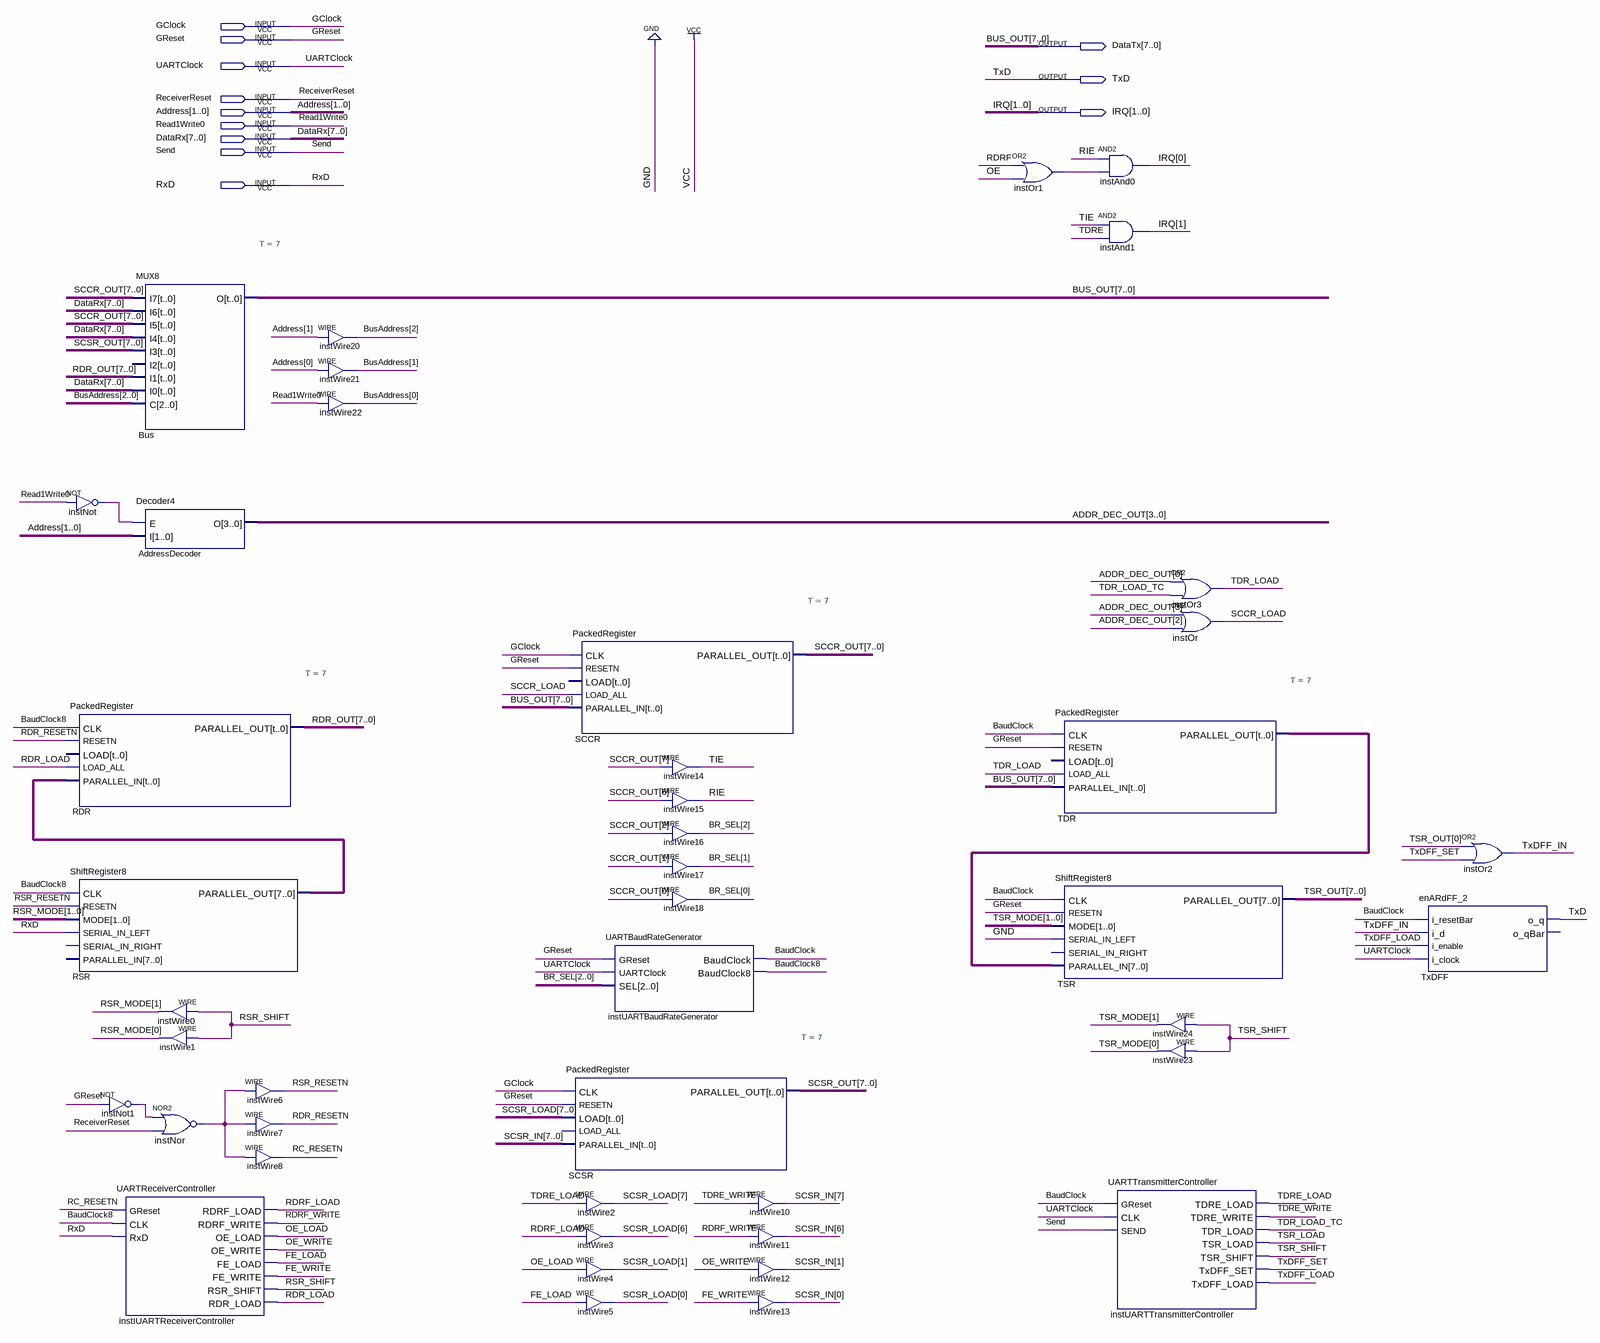
[diagram p0: schematic sheet]
// Quartus schematic UART.bdf as structural Verilog: 44 symbols, 12 pins
module UART (
  input  GClock,
  input  GReset,
  input  UARTClock,
  input  ReceiverReset,
  input  [1:0] Address,
  input  Read1Write0,
  input  [7:0] DataRx,
  input  Send,
  input  RxD,
  output [7:0] DataTx,
  output TxD,
  output [1:0] IRQ
);

  wire BaudClock, BaudClock8, FE_LOAD, FE_WRITE, instNor_out, instNot1_out, instNot_out, instOr1_out, OE,
       OE_LOAD, OE_WRITE, RC_RESETN, RDR_LOAD, RDR_RESETN, RDRF, RDRF_LOAD, RDRF_WRITE, RIE, RSR_RESETN,
       RSR_SHIFT, SCCR_LOAD, TDR_LOAD, TDR_LOAD_TC, TDRE, TDRE_LOAD, TDRE_WRITE, TIE, TSR_LOAD, TSR_SHIFT,
       TxDFF_IN, TxDFF_LOAD, TxDFF_SET;
  wire [1:0] RSR_MODE, TSR_MODE;
  wire [2:0] BR_SEL, BusAddress;
  wire [3:0] ADDR_DEC_OUT;
  wire [7:0] RDR_OUT, RSR_parallel_out, SCCR_OUT, SCSR_IN, SCSR_LOAD, SCSR_OUT, TDR_parallel_out, TSR_OUT;

  not instNot (instNot_out, Read1Write0);
  PackedRegister #(.T(7)) RDR (
    .CLK(BaudClock8), .RESETN(RDR_RESETN), .LOAD_ALL(RDR_LOAD), .PARALLEL_IN(RSR_parallel_out),
    .PARALLEL_OUT(RDR_OUT));  // open: LOAD
  ShiftRegister8 RSR (
    .CLK(BaudClock8), .RESETN(RSR_RESETN), .MODE(RSR_MODE), .SERIAL_IN_LEFT(RxD),
    .PARALLEL_OUT(RSR_parallel_out));  // open: SERIAL_IN_RIGHT, PARALLEL_IN
  not instNot1 (instNot1_out, GReset);
  MUX8 #(.T(7)) Bus (
    .I7(SCCR_OUT), .I6(DataRx), .I5(SCCR_OUT), .I4(DataRx), .I3(SCSR_OUT), .I1(RDR_OUT), .I0(DataRx),
    .C(BusAddress), .O(DataTx));  // open: I2
  Decoder4 AddressDecoder (.E(instNot_out), .I(Address), .O(ADDR_DEC_OUT));
  nor instNor (instNor_out, instNot1_out, ReceiverReset);
  UARTReceiverController instIUARTReceiverController (
    .GReset(RC_RESETN), .CLK(BaudClock8), .RxD(RxD), .RDRF_LOAD(RDRF_LOAD), .RDRF_WRITE(RDRF_WRITE),
    .OE_LOAD(OE_LOAD), .OE_WRITE(OE_WRITE), .FE_LOAD(FE_LOAD), .FE_WRITE(FE_WRITE), .RSR_SHIFT(RSR_SHIFT),
    .RDR_LOAD(RDR_LOAD));
  assign RSR_MODE[1] = RSR_SHIFT;  // WIRE instWire0
  assign RSR_MODE[0] = RSR_SHIFT;  // WIRE instWire1
  assign RSR_RESETN = instNor_out;  // WIRE instWire6
  assign RDR_RESETN = instNor_out;  // WIRE instWire7
  assign RC_RESETN = instNor_out;  // WIRE instWire8
  assign BusAddress[2] = Address[1];  // WIRE instWire20
  assign BusAddress[1] = Address[0];  // WIRE instWire21
  assign BusAddress[0] = Read1Write0;  // WIRE instWire22
  PackedRegister #(.T(7)) SCCR (
    .CLK(GClock), .RESETN(GReset), .LOAD_ALL(SCCR_LOAD), .PARALLEL_IN(DataTx), .PARALLEL_OUT(SCCR_OUT));  // open: LOAD
  PackedRegister #(.T(7)) SCSR (
    .CLK(GClock), .RESETN(GReset), .LOAD(SCSR_LOAD), .PARALLEL_IN(SCSR_IN), .PARALLEL_OUT(SCSR_OUT));  // open: LOAD_ALL
  assign SCSR_LOAD[7] = TDRE_LOAD;  // WIRE instWire2
  assign SCSR_LOAD[6] = RDRF_LOAD;  // WIRE instWire3
  assign SCSR_LOAD[1] = OE_LOAD;  // WIRE instWire4
  assign SCSR_LOAD[0] = FE_LOAD;  // WIRE instWire5
  UARTBaudRateGenerator instUARTBaudRateGenerator (
    .GReset(GReset), .UARTClock(UARTClock), .SEL(BR_SEL), .BaudClock(BaudClock), .BaudClock8(BaudClock8));
  assign TIE = SCCR_OUT[7];  // WIRE instWire14
  assign RIE = SCCR_OUT[6];  // WIRE instWire15
  assign BR_SEL[2] = SCCR_OUT[2];  // WIRE instWire16
  assign BR_SEL[1] = SCCR_OUT[1];  // WIRE instWire17
  assign BR_SEL[0] = SCCR_OUT[0];  // WIRE instWire18
  assign SCSR_IN[7] = TDRE_WRITE;  // WIRE instWire10
  assign SCSR_IN[6] = RDRF_WRITE;  // WIRE instWire11
  assign SCSR_IN[1] = OE_WRITE;  // WIRE instWire12
  assign SCSR_IN[0] = FE_WRITE;  // WIRE instWire13
  or instOr1 (instOr1_out, RDRF, OE);
  PackedRegister #(.T(7)) TDR (
    .CLK(BaudClock), .RESETN(GReset), .LOAD_ALL(TDR_LOAD), .PARALLEL_IN(DataTx),
    .PARALLEL_OUT(TDR_parallel_out));  // open: LOAD
  ShiftRegister8 TSR (
    .CLK(BaudClock), .RESETN(GReset), .MODE(TSR_MODE), .SERIAL_IN_LEFT(1'b0), .PARALLEL_IN(TDR_parallel_out),
    .PARALLEL_OUT(TSR_OUT));  // open: SERIAL_IN_RIGHT
  and instAnd0 (IRQ[0], RIE, instOr1_out);
  and instAnd1 (IRQ[1], TIE, TDRE);
  UARTTransmitterController instUARTTransmitterController (
    .GReset(BaudClock), .CLK(UARTClock), .SEND(Send), .TDRE_LOAD(TDRE_LOAD), .TDRE_WRITE(TDRE_WRITE),
    .TDR_LOAD(TDR_LOAD_TC), .TSR_LOAD(TSR_LOAD), .TSR_SHIFT(TSR_SHIFT), .TxDFF_SET(TxDFF_SET),
    .TxDFF_LOAD(TxDFF_LOAD));
  assign TSR_MODE[1] = TSR_SHIFT;  // WIRE instWire24
  assign TSR_MODE[0] = TSR_SHIFT;  // WIRE instWire23
  or instOr3 (TDR_LOAD, ADDR_DEC_OUT[0], TDR_LOAD_TC);
  or instOr (SCCR_LOAD, ADDR_DEC_OUT[3], ADDR_DEC_OUT[2]);
  enARdFF_2 TxDFF (
    .i_resetBar(BaudClock), .i_d(TxDFF_IN), .i_enable(TxDFF_LOAD), .i_clock(UARTClock), .o_q(TxD));  // open: o_qBar
  or instOr2 (TxDFF_IN, TSR_OUT[0], TxDFF_SET);

  // Other names for the same wires on the sheet: BUS_OUT[7:0] = DataTx
endmodule
